# EAGLE schematic adapter_sf (EAGLE 5.11)
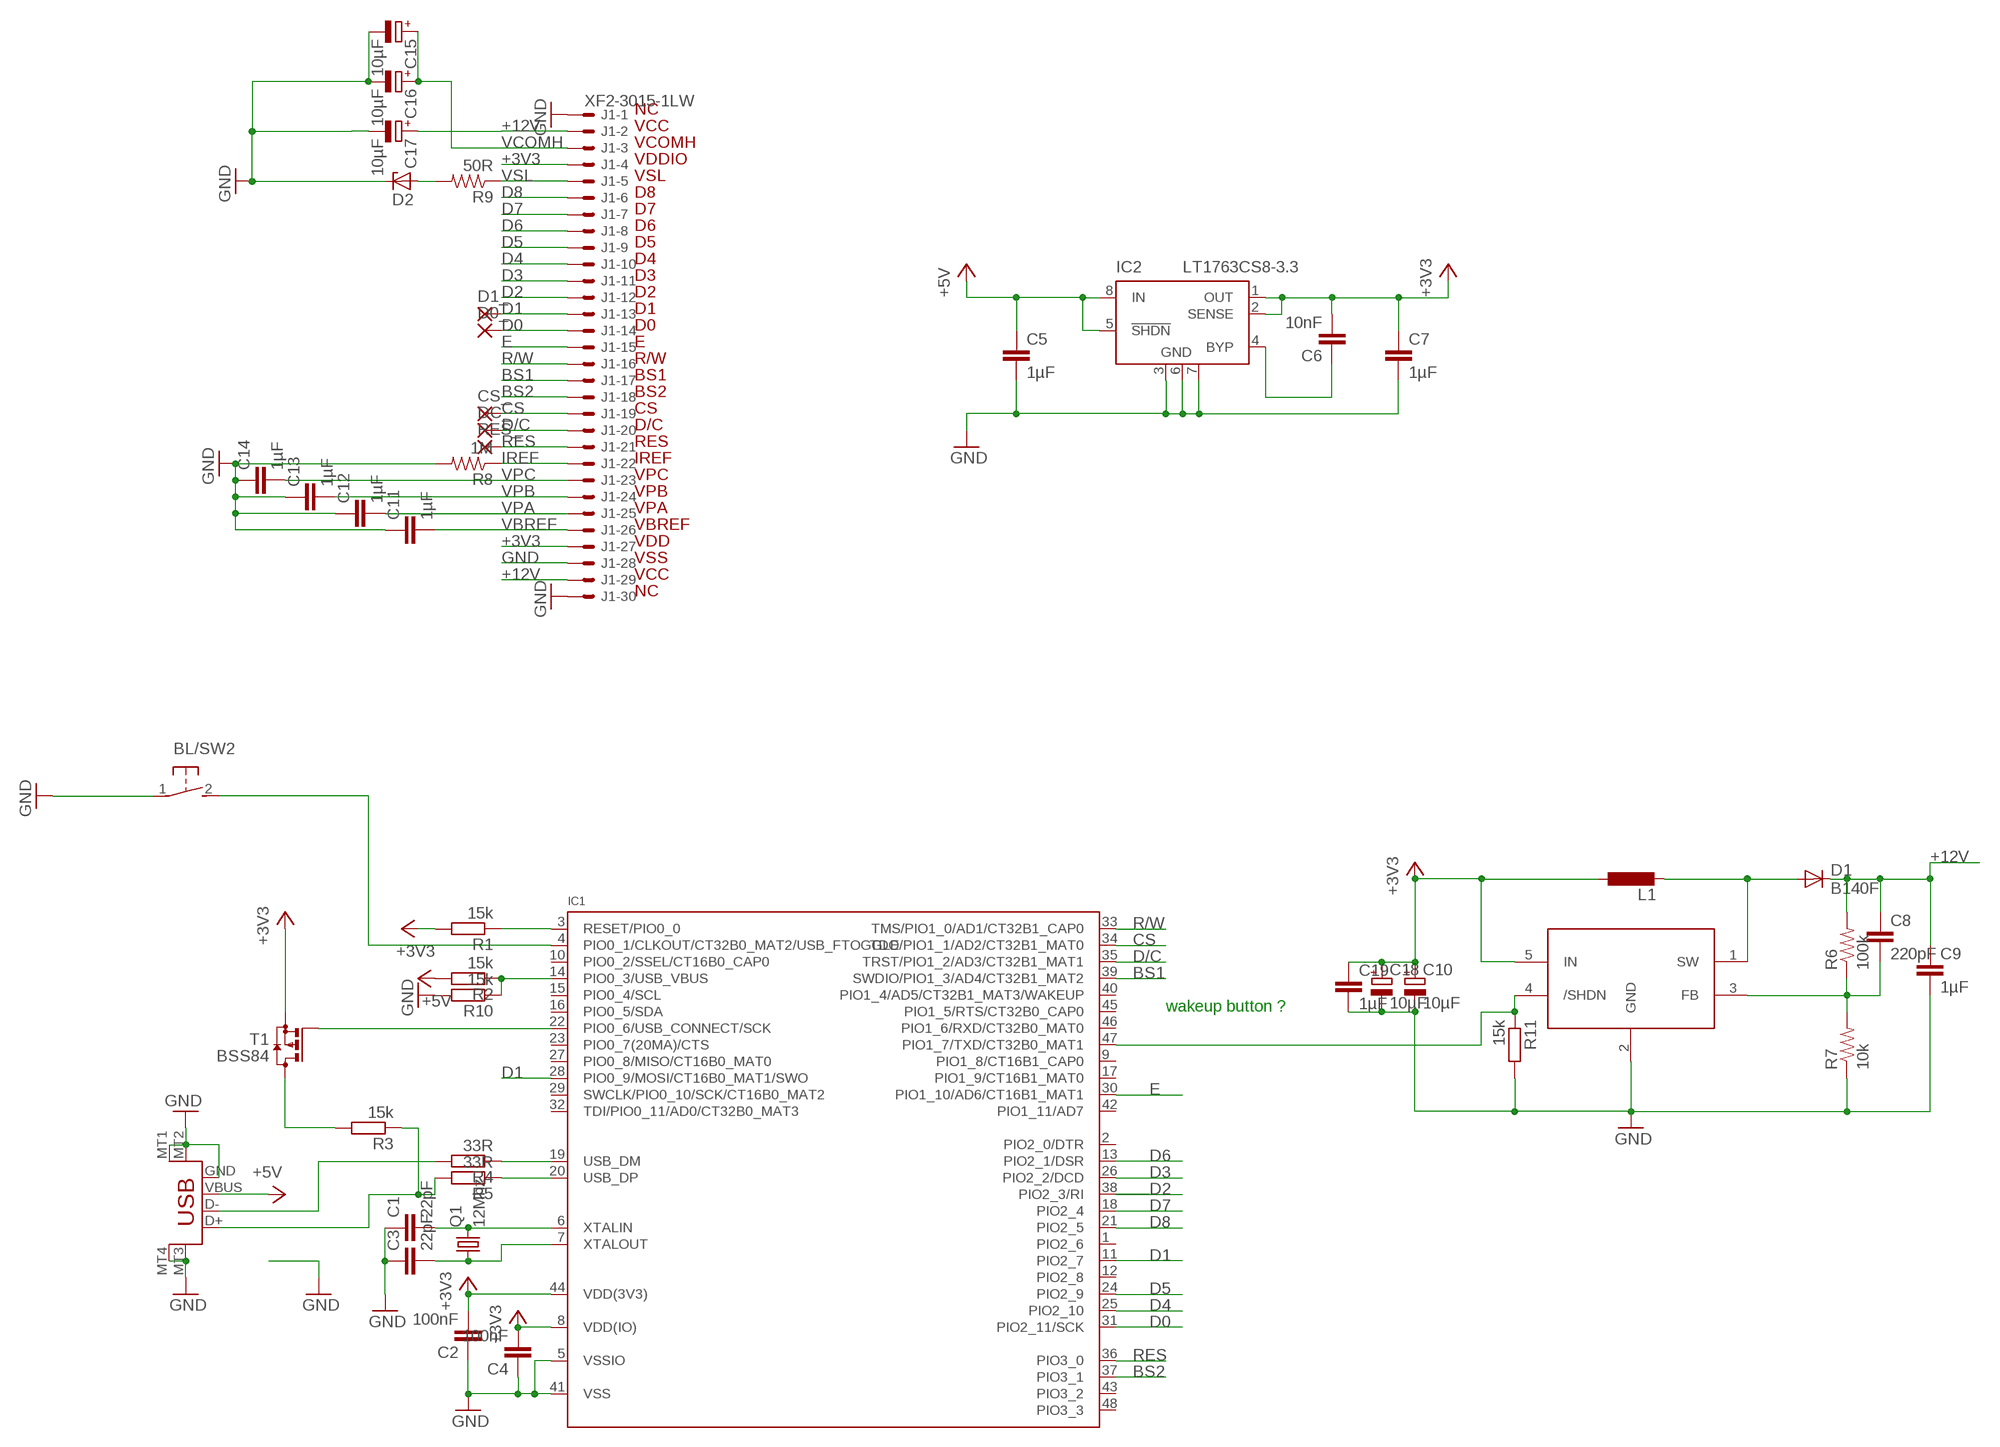
[diagram p0: schematic, sheet 1]

## Parts
BL/SW2  SWITCH_MCTAEF  [SWITCH_MCTAEF]
C1  22pF  C-EUC0402  [C0402]
C2  100nF  C-EUC0402  [C0402]
C3  22pF  C-EUC0402  [C0402]
C4  100nF  C-EUC0402  [C0402]
C5  1µF  CAP0805  [0805]
C6  10nF  C-EUC0402  [C0402]
C7  1µF  CAP0805  [0805]
C8  220pF  CAP0805  [0805]
C9  1µF  CAP0805  [0805]
C10  10µF  CPOL-EUSMCA  [SMC_A]
C11  1µF  CAP0805  [0805]
C12  1µF  CAP0805  [0805]
C13  1µF  CAP0805  [0805]
C14  1µF  CAP0805  [0805]
C15  10µF  CPOL-EUSMCA  [SMC_A]
C16  10µF  CPOL-EUSMCA  [SMC_A]
C17  10µF  CPOL-EUSMCA  [SMC_A]
C18  10µF  CPOL-EUSMCA  [SMC_A]
C19  1µF  CAP0805  [0805]
CS_  SMD2  [SMD1,27-2,54]
D0_  SMD2  [SMD1,27-2,54]
D1  B140F  DIODE-DO214AC  [DO214AC]
D1_  SMD2  [SMD1,27-2,54]
D2  ZENER-DIODESOT23  [SOT23]
DC_  SMD2  [SMD1,27-2,54]
IC1  LPC1343_QFP  [LQFP48]
IC2  LT1763CS8-3.3  [SOIC8]
IC3  LM27313  [SOT23-5L]
J1  XF2-3015-1LW  [XF2H-3015-1LW]
L1  L-EUL1812  [L1812]
Q1  12Mhz  MT-OSCILLATOR  [MT]
R1  15k  R-EU_R0402  [R0402]
R2  15k  R-EU_R0402  [R0402]
R3  15k  R-EU_R0402  [R0402]
R4  33R  R-EU_R0402  [R0402]
R5  33R  R-EU_R0402  [R0402]
R6  100k  RESISTOR0805-RES  [0805]
R7  10k  RESISTOR0805-RES  [0805]
R8  1M  RESISTOR0805-RES  [0805]
R9  50R  RESISTOR0805-RES  [0805]
R10  15k  R-EU_R0402  [R0402]
R11  15k  R-EU_R0402  [R0402]
RES_  SMD2  [SMD1,27-2,54]
T1  BSS84  [SOT23]
X1  USB-MICROB  [USB-MICROB]

## Nets
+3V3: C2.2 C4.2 C6.2 C7.1 C10.+ C18.+ C19.1 IC1.8(VDD(IO)) IC1.44(VDD(3V3)) IC2.1(OUT) IC2.2(SENSE) IC3.5(IN) J1.4 J1.27 L1.1 R1.2 T1.2(S)
+5V: C5.1 IC2.5(!SHDN) IC2.8(IN) R2.2 X1.VBUS
+12V: C8.1 C9.1 C17.+ D1.C J1.2 J1.29 R6.2
BS1: IC1.39(SWDIO/PIO1_3/AD4/CT32B1_MAT2) J1.17
BS2: IC1.37(PIO3_1) J1.18
CS: CS_.1(P) IC1.34(TDO/PIO1_1/AD2/CT32B1_MAT0) J1.19
D0: D0_.1(P) IC1.31(PIO2_11/SCK) J1.14
D1: D1_.1(P) IC1.11(PIO2_7) IC1.28(PIO0_9/MOSI/CT16B0_MAT1/SWO) J1.13
D2: IC1.38(PIO2_3/RI) J1.12
D3: IC1.26(PIO2_2/DCD) J1.11
D4: IC1.25(PIO2_10) J1.10
D5: IC1.24(PIO2_9) J1.9
D6: IC1.13(PIO2_1/DSR) J1.8
D7: IC1.18(PIO2_4) J1.7
D8: IC1.21(PIO2_5) J1.6
D/C: DC_.1(P) IC1.35(TRST/PIO1_2/AD3/CT32B1_MAT1) J1.20
E: IC1.30(PIO1_10/AD6/CT16B1_MAT1) J1.15
GND: BL/SW2.1 C1.1 C2.1 C3.1 C4.1 C5.2 C7.2 C9.2 C10.- C11.1 C12.1 C13.1 C14.1 C15.- C16.- C17.- C18.- C19.2 D2.3(C) IC1.5(VSSIO) IC1.41(VSS) IC2.3(GND) IC2.6(GND) IC2.7(GND) IC3.2(GND) J1.1 J1.28 J1.30 R7.1 R8.2 R10.2 R11.2 X1.GND X1.MT1(GND) X1.MT2(GND) X1.MT3(GND) X1.MT4(GND)
IREF: J1.22 R8.1
N$1: D1.A IC3.1(SW) L1.2
N$2: D2.1(A) R9.2
N$3: C3.2 IC1.7(XTALOUT) Q1.1
N$4: C1.2 IC1.6(XTALIN) Q1.3
N$5: C6.1 IC2.4(BYP)
N$6: C8.2 IC3.3(FB) R6.1 R7.2
N$7: IC1.3(RESET/PIO0_0) R1.1
N$8: R3.2 T1.3(D)
N$9: IC1.22(PIO0_6/USB_CONNECT/SCK) T1.1(G)
N$10: R3.1 R5.2 X1.D+
N$11: R4.2 X1.D-
N$12: IC1.14(PIO0_3/USB_VBUS) R2.1 R10.1
N$13: IC1.47(PIO1_7/TXD/CT32B0_MAT1) IC3.4(/SHDN) R11.1
N$14: IC1.19(USB_DM) R4.1
N$21: BL/SW2.2 IC1.4(PIO0_1/CLKOUT/CT32B0_MAT2/USB_FTOGGLE)
N$24: IC1.20(USB_DP) R5.1
R/W: IC1.33(TMS/PIO1_0/AD1/CT32B1_CAP0) J1.16
RES: IC1.36(PIO3_0) J1.21 RES_.1(P)
VBREF: C11.2 J1.26
VCOMH: C15.+ C16.+ J1.3
VPA: C12.2 J1.25
VPB: C13.2 J1.24
VPC: C14.2 J1.23
VSL: J1.5 R9.1
Unconnected: IC1.1(PIO2_6) IC1.2(PIO2_0/DTR) IC1.9(PIO1_8/CT16B1_CAP0) IC1.10(PIO0_2/SSEL/CT16B0_CAP0) IC1.12(PIO2_8) IC1.15(PIO0_4/SCL) IC1.16(PIO0_5/SDA) IC1.17(PIO1_9/CT16B1_MAT0) IC1.23(PIO0_7(20MA)/CTS) IC1.27(PIO0_8/MISO/CT16B0_MAT0) IC1.29(SWCLK/PIO0_10/SCK/CT16B0_MAT2) IC1.32(TDI/PIO0_11/AD0/CT32B0_MAT3) IC1.40(PIO1_4/AD5/CT32B1_MAT3/WAKEUP) IC1.42(PIO1_11/AD7) IC1.43(PIO3_2) IC1.45(PIO1_5/RTS/CT32B0_CAP0) IC1.46(PIO1_6/RXD/CT32B0_MAT0) IC1.48(PIO3_3)

## Notes on the sheet
- NC
- VCC
- VCOMH
- VDDIO
- VSL
- D8
- D7
- D6
- D5
- D4
- D3
- D2
- D1
- D0
- E
- R/W
- BS1
- BS2
- CS
- D/C
- RES
- IREF
- VPC
- VPB
- VPA
- VBREF
- VDD
- VSS
- VCC
- NC
- wakeup button ?

## Library data of the parts
BL/SW2 = seb:SWITCH_MCTAEF
C1-C4 C6 = rcl:C-EU: CAPACITOR, European symbol
C5 C7-C9 C11-C14 C19 = SparkFun:CAP: Capacitor Standard 0603 ceramic capacitor, and 0.1" leaded capacitor.
C10 C15-C18 = rcl:CPOL-EU: POLARIZED CAPACITOR, European symbol
CS_ D0_ D1_ DC_ RES_ = wirepad:SMD2: SMD PAD
D1 = diode:DIODE-: DIODE
D2 = diode:ZENER-DIODE: Z-Diode
IC1 = microbuilder:LPC1343_QFP: LPC1343 72 MHz 32-bit ARM Cortex-M3 microcontroller. 32 kB Flash, 8 kB SRAM, USB Device Mouser: 771-LPC1343FBD48151 Digikey: 568-4945-ND; DIGIKEY#: 568-4945-ND; MANF: NXP; MANF#: LPC1343FBD48,151
IC2 = linear-technology:LT1763CS8: 500mA, Low Noise, LDO Micropower Regulators Source: http://cds.linear.com/docs/Datasheet/1763ff.pdf; MPN: LT1763CS8-3.3; OC_FARNELL: 1273617; OC_NEWARK: 57M6055
IC3 = seb:LM27313
J1 = con-omron:XF2*-30?: OMRON FPC Connector Source : http://www.omron.com/ecb/products/pdf/fpc.pdf; OC_FARNELL: unknown; OC_NEWARK: unknown
L1 = resistor:L-EU: INDUCTOR, European symbol
Q1 = seb:MT-OSCILLATOR
R1-R5 R10 R11 = rcl:R-EU_: RESISTOR, European symbol
R6-R9 = SparkFun:RESISTOR: Resistor Basic schematic elements and footprints for 0603, 1206, and PTH resistors.
T1 = transistor-small-signal:BSS84: P-CHANNEL MOS FET
X1 = SparkFun:USB: USB Connectors USB-B-PTH is fully proven SKU : PRT-00139 USB-miniB is fully proven SKU : PRT-00587 USB-A-PCB is untested. USB-A-H is throughly reviewed, but untested. Spark Fun Electronics SKU : PRT-00437 USB-B-SMT is throughly reviewed, but untested. Needs silkscreen touching up. USB-A-S has not been used/tested USB-MB-H has not been used/tested